# EAGLE design Starlings Technology nrf52 (EAGLE 9.6.2)
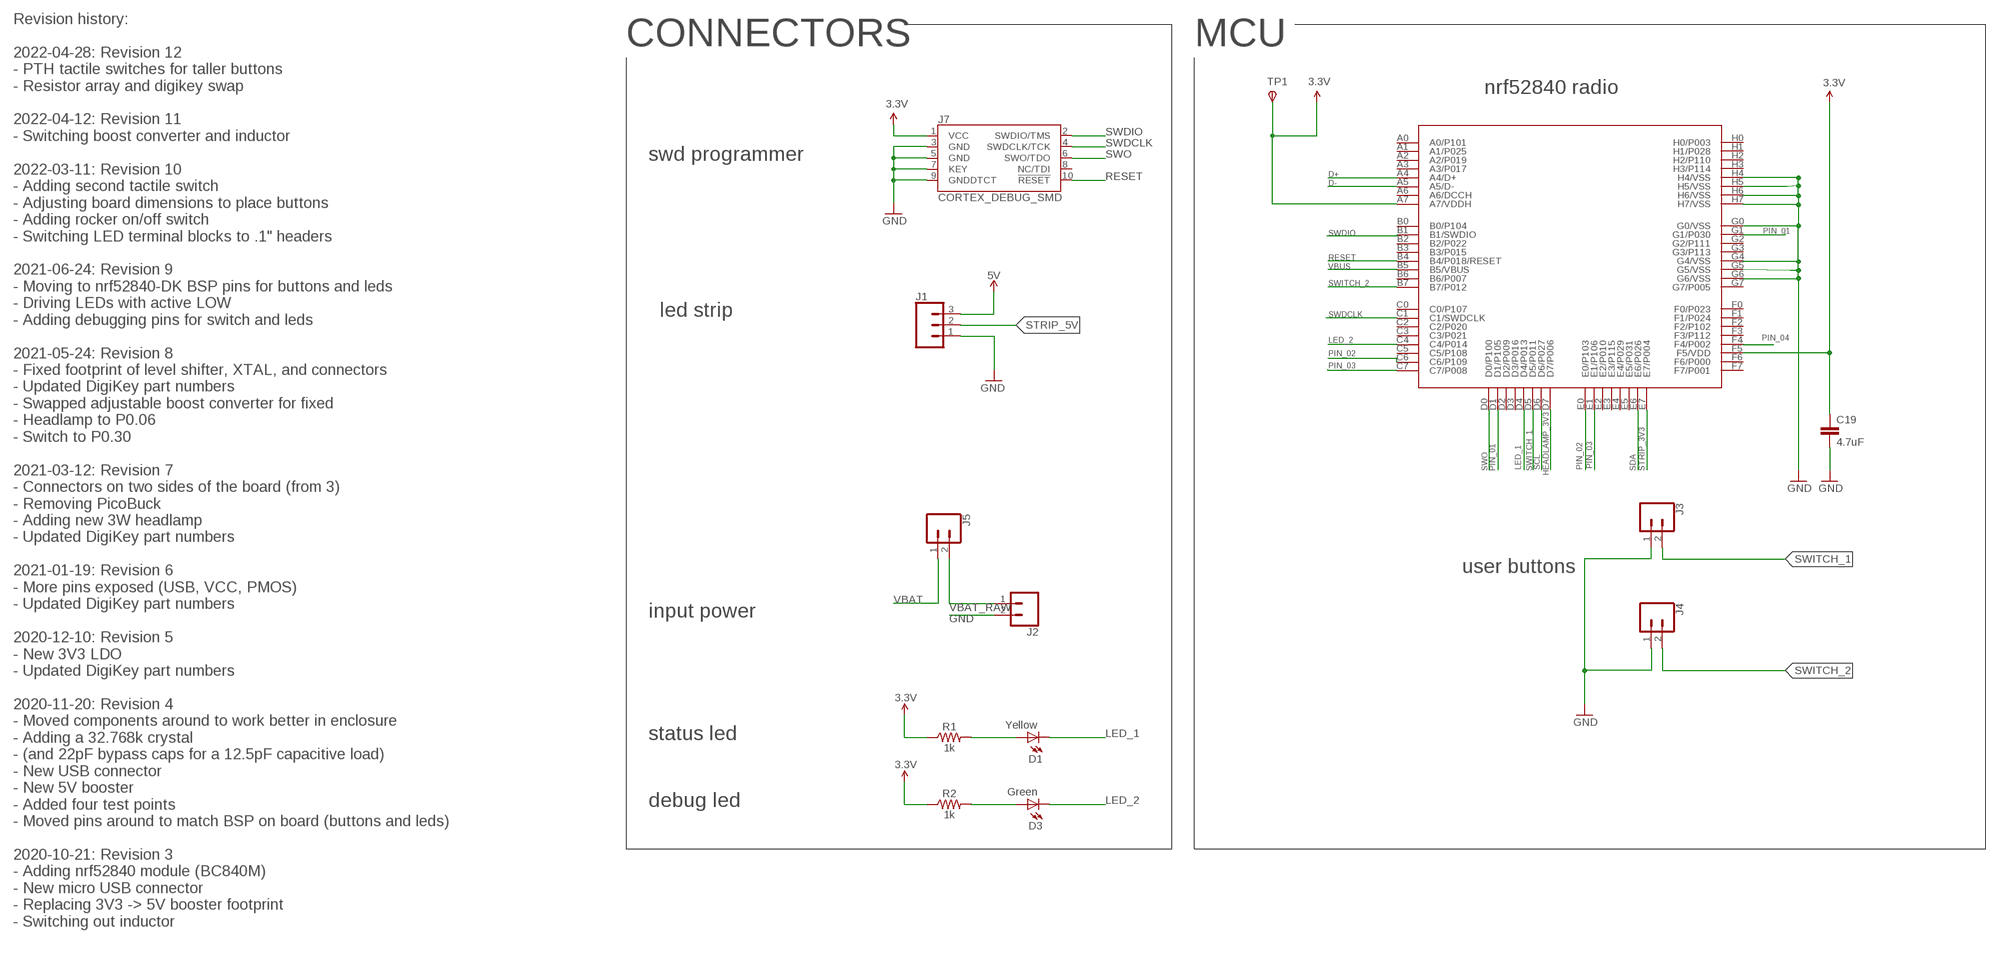
[diagram p0: schematic, sheet 1, part 1 of 2]
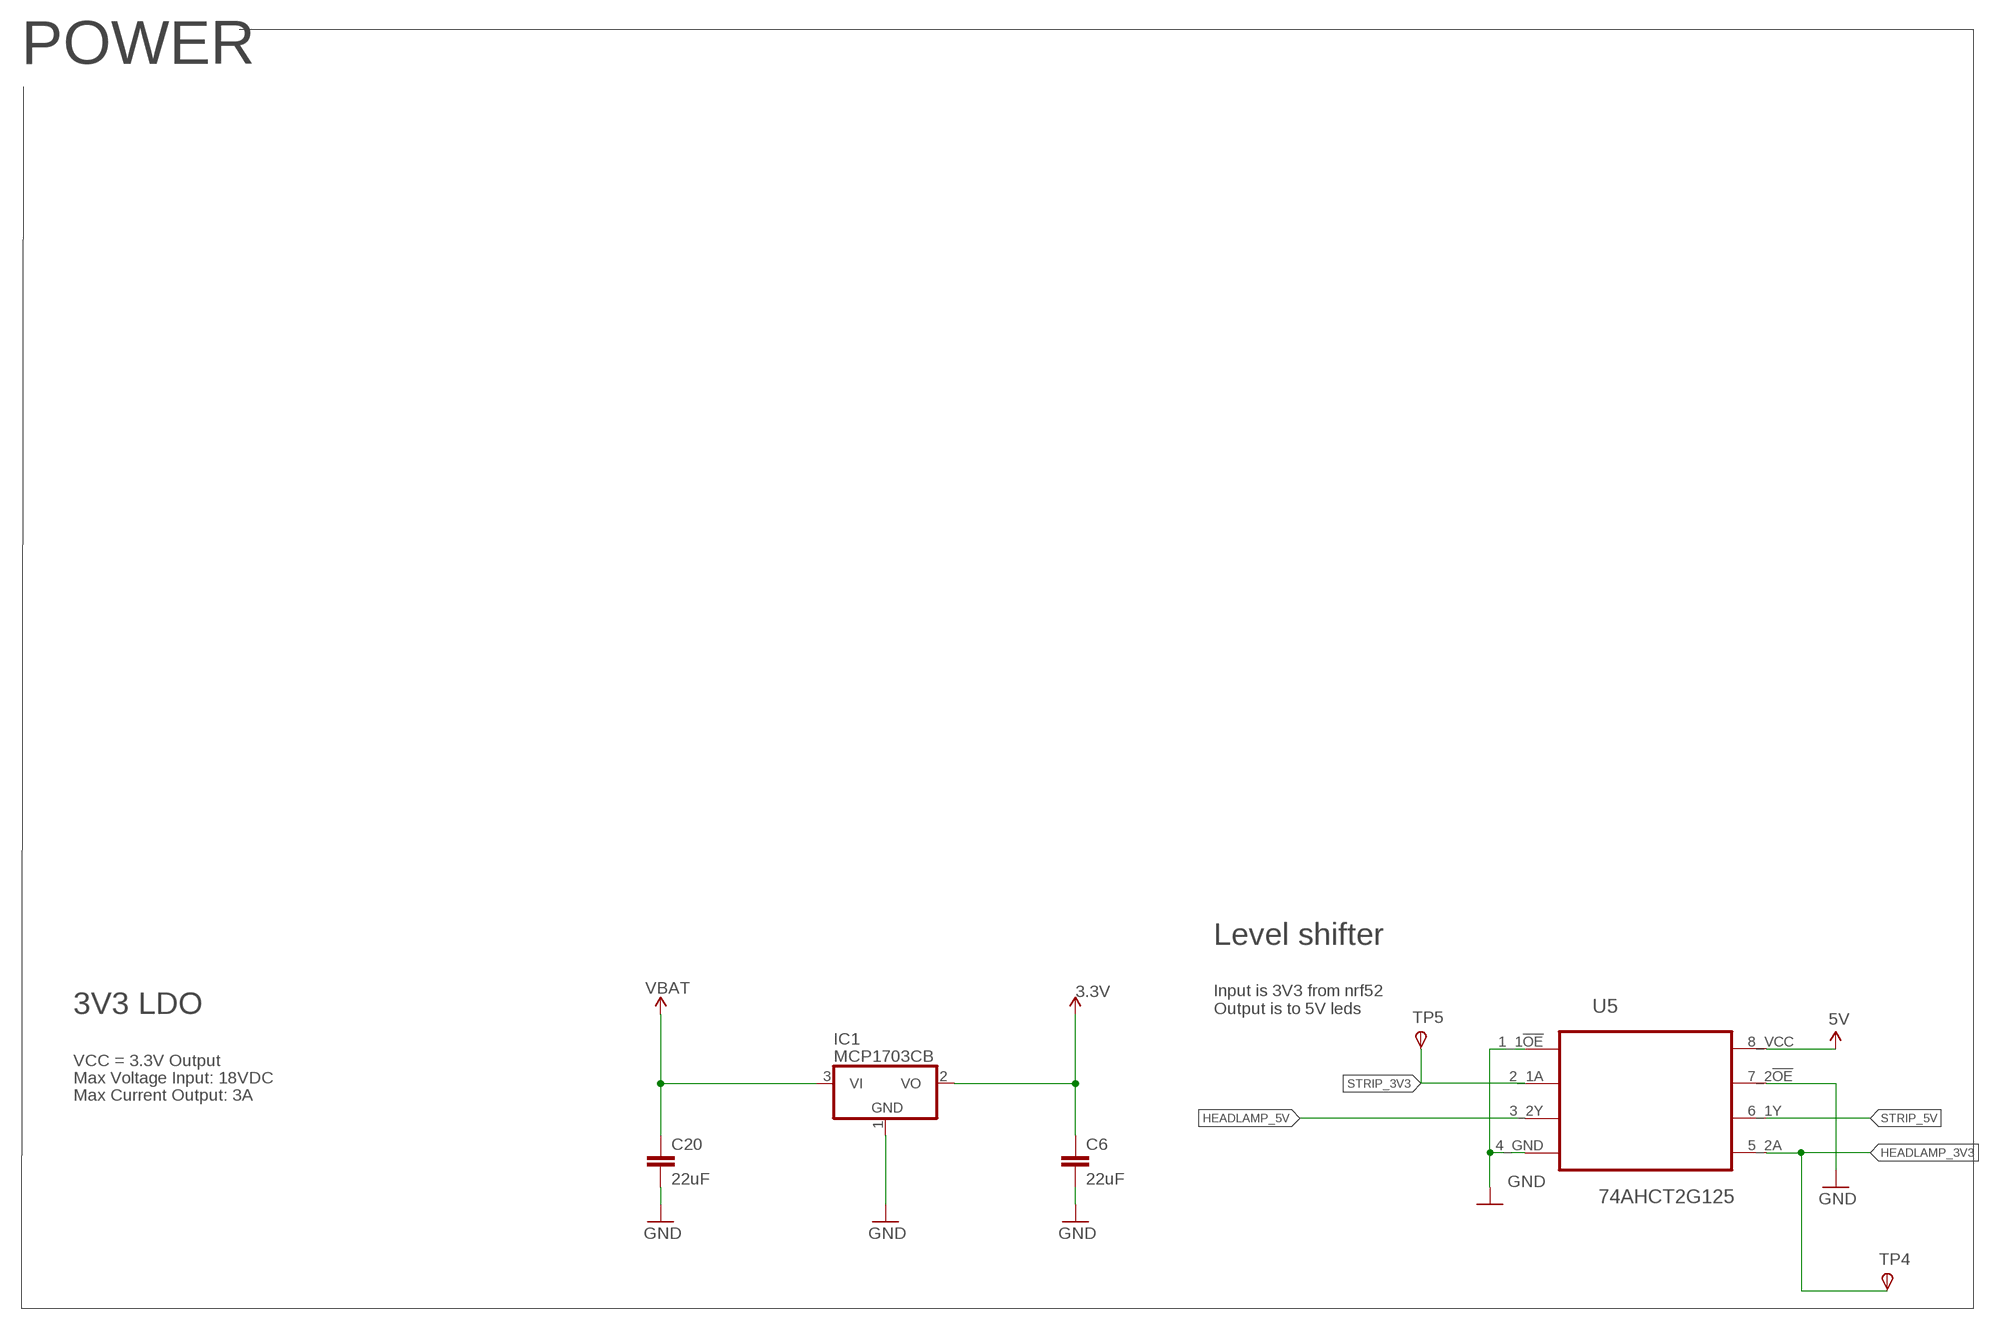
[diagram p1: schematic, sheet 1, part 2 of 2]

## Parts
C6  22uF  22UF-0805-6.3V-20%  [0805]
C19  4.7uF  4.7UF0603  [0603]
C20  22uF  22UF-0805-6.3V-20%  [0805]
D1  Yellow  LED0603  [LED-0603]
D3  Green  LED0603  [LED-0603]
IC1  MCP1703CB  [SOT23]
J1  CONN_03LOCK_LONGPADS  [1X03_LOCK_LONGPADS]
J2  CONN_02LOCK_LONGPADS  [1X02_LOCK_LONGPADS]
J3  CONN_02LOCK_LONGPADS  [1X02_LOCK_LONGPADS]
J4  CONN_02LOCK_LONGPADS  [1X02_LOCK_LONGPADS]
J5  CONN_02LOCK_LONGPADS  [1X02_LOCK_LONGPADS]
J7  CORTEX_DEBUG_SMD  [SAMTECH_FTSH-105-01]
R1  1k  1KOHM-0603-1/10W-1%  [0603]
R2  1k  1KOHM-0603-1/10W-1%  [0603]
TP1  TPSB1,27  [B1,27]
TP4  TPSB1,27  [B1,27]
TP5  TPSB1,27  [B1,27]
U3  BC840M  [BC840M]
U5  74AHCT2G125  VSSOP-8_DEVICE  [VSSOP-8]

## Nets
3.3V: C6.1 C19.1 IC1.2(VO) J7.1(VCC) R1.1 R2.1 TP1.TP(PP) U3.A7(A7/VDDH) U3.F5(F5/VDD) ; supply symbol labelled VCC
5V: J1.3 U5.8_VCC
D+: U3.A4(A4/D+)
D-: U3.A5(A5/D-)
GND: C6.2 C19.2 C20.2 IC1.1(GND) J1.1 J2.2 J3.1 J4.1 J7.3(GND) J7.5(GND) J7.7(KEY) J7.9(GNDDTCT) U3.G0(G0/VSS) U3.G4(G4/VSS) U3.G5(G5/VSS) U3.G6(G6/VSS) U3.H4(H4/VSS) U3.H5(H5/VSS) U3.H6(H6/VSS) U3.H7(H7/VSS) U5.1_1!OE U5.4_GND U5.7_2!OE
HEADLAMP_3V3: TP4.TP(PP) U3.D7(D7/P006) U5.5_2A
HEADLAMP_5V: U5.3_2Y
LED_1: D1.C U3.D4(D4/P013)
LED_2: D3.C U3.C4(C4/P014)
N$1: D1.A R1.2
N$8: D3.A R2.2
PIN_01: U3.D1(D1/P105) U3.G1(G1/P030)
PIN_02: U3.C6(C6/P109) U3.E0(E0/P103)
PIN_03: U3.C7(C7/P008) U3.E1(E1/P106)
PIN_04: U3.F4(F4/P002)
RESET: J7.10(!RESET) U3.B4(B4/P018/RESET)
SCL: U3.D6(D6/P027)
SDA: U3.E6(E6/P026)
STRIP_3V3: TP5.TP(PP) U3.E7(E7/P004) U5.2_1A
STRIP_5V: J1.2 U5.6_1Y
SWDCLK: J7.4(SWDCLK/TCK) U3.C1(C1/SWDCLK)
SWDIO: J7.2(SWDIO/TMS) U3.B1(B1/SWDIO)
SWITCH_1: J3.2 U3.D5(D5/P011)
SWITCH_2: J4.2 U3.B7(B7/P012)
SWO: J7.6(SWO/TDO) U3.D0(D0/P100)
VBAT: C20.1 IC1.3(VI) J5.1
VBAT_RAW: J2.1 J5.2
VBUS: U3.B5(B5/VBUS)
Unconnected: J7.8(NC/TDI) U3.A0(A0/P101) U3.A1(A1/P025) U3.A2(A2/P019) U3.A3(A3/P017) U3.A6(A6/DCCH) U3.B0(B0/P104) U3.B2(B2/P022) U3.B3(B3/P015) U3.B6(B6/P007) U3.C0(C0/P107) U3.C2(C2/P020) U3.C3(C3/P021) U3.C5(C5/P108) U3.D2(D2/P009) U3.D3(D3/P016) U3.E2(E2/P010) U3.E3(E3/P115) U3.E4(E4/P029) U3.E5(E5/P031) U3.F0(F0/P023) U3.F1(F1/P024) U3.F2(F2/P102) U3.F3(F3/P112) U3.F6(F6/P000) U3.F7(F7/P001) U3.G2(G2/P111) U3.G3(G3/P113) U3.G7(G7/P005) U3.H0(H0/P003) U3.H1(H1/P028) U3.H2(H2/P110) U3.H3(H3/P114)

## Notes on the sheet
- Revision history:
  
  2022-04-28: Revision 12
  - PTH tactile switches for taller buttons
  - Resistor array and digikey swap
  
  2022-04-12: Revision 11
  - Switching boost converter and inductor
  
  2022-03-11: Revision 10
  - Adding second tactile switch
  - Adjusting board dimensions to place buttons
  - Adding rocker on/off switch
  - Switching LED terminal blocks to .1" headers
  
  2021-06-24: Revision 9
  - Moving to nrf52840-DK BSP pins for buttons and leds
  - Driving LEDs with active LOW
  - Adding debugging pins for switch and leds
  
  2021-05-24: Revision 8
  - Fixed footprint of level shifter, XTAL, and connectors
  - Updated DigiKey part numbers
  - Swapped adjustable boost converter for fixed
  - Headlamp to P0.06
  - Switch to P0.30
  
  2021-03-12: Revision 7
  - Connectors on two sides of the board (from 3)
  - Removing PicoBuck
  - Adding new 3W headlamp
  - Updated DigiKey part numbers
  
  2021-01-19: Revision 6
  - More pins exposed (USB, VCC, PMOS)
  - Updated DigiKey part numbers
  
  2020-12-10: Revision 5
  - New 3V3 LDO
  - Updated DigiKey part numbers
  
  2020-11-20: Revision 4
  - Moved components around to work better in enclosure
  - Adding a 32.768k crystal 
  - (and 22pF bypass caps for a 12.5pF capacitive load) 
  - New USB connector
  - New 5V booster
  - Added four test points
  - Moved pins around to match BSP on board (buttons and leds)
  
  2020-10-21: Revision 3
  - Adding nrf52840 module (BC840M)
  - New micro USB connector
  - Replacing 3V3 -> 5V booster footprint
  - Switching out inductor
- CONNECTORS | MCU | POWER
- nrf52840 radio
- swd programmer
- led strip
- user buttons
- input power
- Level shifter
- 3V3 LDO
- Input is 3V3 from nrf52
  Output is to 5V leds
- VCC = 3.3V Output
- Max Voltage Input: 18VDC
- Max Current Output: 3A
- status led
- debug led

## Library data of the parts
C6 C20 = SparkFun-Capacitors:22UF: 22µF ceramic capacitors A capacitor is a passive two-terminal electrical component used to store electrical energy temporarily in an electric field.; DIGIKEY: 490-10511-1-ND; PROD_ID: CAP-08402
C19 = SparkFun-Capacitors:4.7UF: 4.7µF ceramic capacitors A capacitor is a passive two-terminal electrical component used to store electrical energy temporarily in an electric field.; DIGIKEY: 399-3482-1-ND; PROD_ID: CAP-08280
D1 = SparkFun:LED: LEDs Standard schematic elements and footprints for 5mm, 3mm, 1206, and 0603 sized LEDs. 5mm - Spark Fun Electronics SKU : COM-00529 (and others); DIGIKEY: 350-4349-2-ND
D3 = SparkFun:LED: LEDs Standard schematic elements and footprints for 5mm, 3mm, 1206, and 0603 sized LEDs. 5mm - Spark Fun Electronics SKU : COM-00529 (and others); DIGIKEY: 754-1116-1-ND
IC1 = linear:MCP1703: 250 mA, 16V, Low Quiescent Current LDO Regulator Source: http://ww1.microchip.com/downloads/en/DeviceDoc/22049b.pdf; DIGIKEY: AP2138N-3.3TRG1DICT-ND
J1 = SparkFun-Connectors:CONN_03: Multi connection point. Often used as Generic Header-pin footprint for 0.1 inch spaced/style header connections On any of the 0.1 inch spaced packages, you can populate with these: Break Away Headers - Straight <https://www.sparkfun.com/products/116> (PRT-00116) Break Away Male Headers - Right Angle <https://www.sparkfun.com/products/553> (PRT-00553) Female Headers <https://www.sparkfun.com/products/115> (PRT-00115) Break Away Headers - Machine Pin <https://www.sparkfun.com/products/117> (PRT-00117) Break Away Female Headers - Swiss Machine Pin <https://www.sparkfun.com/products/743> (PRT-00743) Stackable Header - 3 Pin (Female, 0.1") <https://www.sparkfun.com/products/13875> (PRT-13875) For SCREWTERMINALS and SPRING TERMINALS visit here: Screw Terimnals on SparkFun.com <https://www.sparkfun.com/search/results?term=Screw+Terminals> (5mm/3.5mm/2.54mm spacing) This device is also useful as a general connection point to wire up your design to another part of your project. Our various solder wires solder well into these plated through hole pads. Hook-Up Wire - Assortment (Stranded, 22 AWG) <https://www.sparkfun.com/products/11375> (PRT-11375) Hook-Up Wire - Assortment (Solid Core, 22 AWG) <https://www.sparkfun.com/products/11367> (PRT-11367) View the entire wire category on our website here <https://www.sparkfun.com/categories/141> Special notes: Molex polarized connector foot print use with SKU : PRT-08232 with associated crimp pins and housings.; DIGIKEY: S1111EC-03-ND
J2-J5 = SparkFun-Connectors:CONN_02: Multi connection point. Often used as Generic Header-pin footprint for 0.1 inch spaced/style header connections On any of the 0.1 inch spaced packages, you can populate with these: Break Away Headers - Straight <https://www.sparkfun.com/products/116> (PRT-00116) Break Away Male Headers - Right Angle <https://www.sparkfun.com/products/553> (PRT-00553) Female Headers <https://www.sparkfun.com/products/115> (PRT-00115) Break Away Headers - Machine Pin <https://www.sparkfun.com/products/117> (PRT-00117) Break Away Female Headers - Swiss Machine Pin <https://www.sparkfun.com/products/743> (PRT-00743) For SCREWTERMINALS and SPRING TERMINALS visit here: Screw Terimnals on SparkFun.com <https://www.sparkfun.com/search/results?term=Screw+Terminals> (5mm/3.5mm/2.54mm spacing) This device is also useful as a general connection point to wire up your design to another part of your project. Our various solder wires solder well into these plated through hole pads. Hook-Up Wire - Assortment (Stranded, 22 AWG) <https://www.sparkfun.com/products/11375> (PRT-11375) Hook-Up Wire - Assortment (Solid Core, 22 AWG) <https://www.sparkfun.com/products/11367> (PRT-11367) View the entire wire category on our website here <https://www.sparkfun.com/categories/141> Special notes: Molex polarized connector foot print use with: PRT-08233 with associated crimp pins and housings. 2.54_SCREWTERM for use with PRT-10571. 3.5mm Screw Terminal footprints for PRT-08084 5mm Screw Terminal footprints for use with PRT-08432
J7 = SparkFun-Connectors:CORTEX_DEBUG: Cortex Debug Connector - 10 pin Supports JTAG debug, Serial Wire debug, and Serial Wire Viewer. PTH and SMD connector options available. General Connector Information <http://infocenter.arm.com/help/topic/com.arm.doc.faqs/attached/13634/cortex_debug_connectors.pdf> Products: PTH Connector <http://www.digikey.com/product-detail/en/cnc-tech/3220-10-0100-00/1175-1627-ND/3883661> -via Digi-Key SparkFun PSoc <https://www.sparkfun.com/products/13229> SparkFun T <https://www.sparkfun.com/products/13810>; DIGIKEY: SAM1161-05-ND
R1 R2 = SparkFun-Resistors:1KOHM: 1kΩ resistor A resistor is a passive two-terminal electrical component that implements electrical resistance as a circuit element. Resistors act to reduce current flow, and, at the same time, act to lower voltage levels within circuits. - Wikipedia; DIGIKEY: RNCP0603FTD1K00CT-ND; PROD_ID: RES-07856
TP1 TP4 TP5 = testpad:TPS: TEST PIN
U3 = BC840M-v1:BC840M; DIGIKEY: 1914-BC840CT-ND
U5 = VSSOP8:VSSOP-8_DEVICE: Dual bidirectional I2C-bus and SMBus voltage-level translator; DIGIKEY: 1727-6544-1-ND‎; MPN: PCA9306DC,125; OC_FARNELL: -; OC_NEWARK: 70R6429; PACKAGE: VSSOP-8; SUPPLIER: NXP

## Net classes
0 default: width 0.127 mm, drill 0.305 mm, clearance 0.152 mm
1 power: width 0.508 mm

## Board
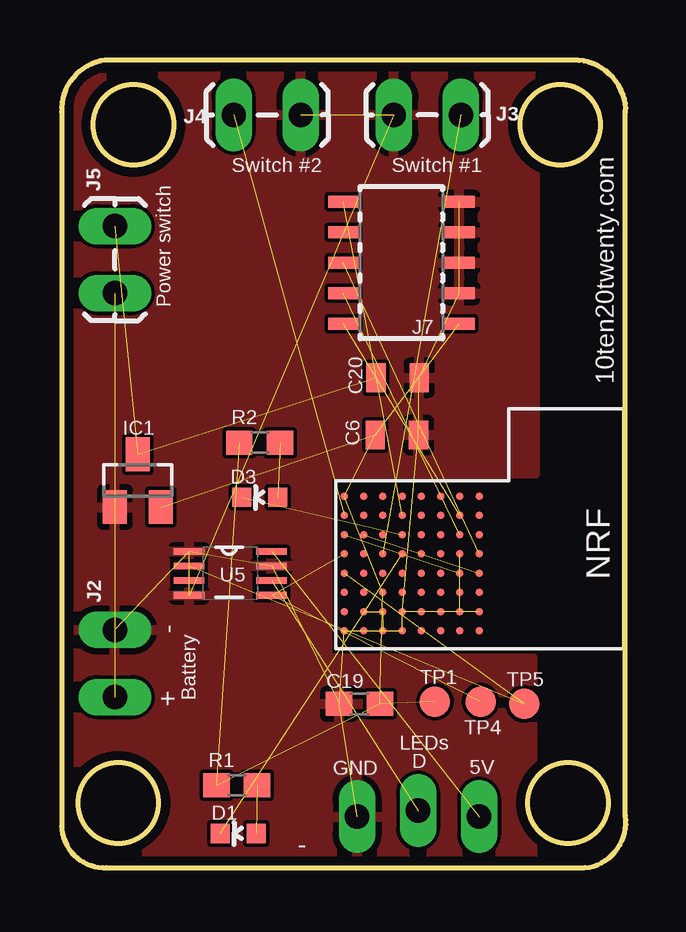
[diagram p2: board, top side]
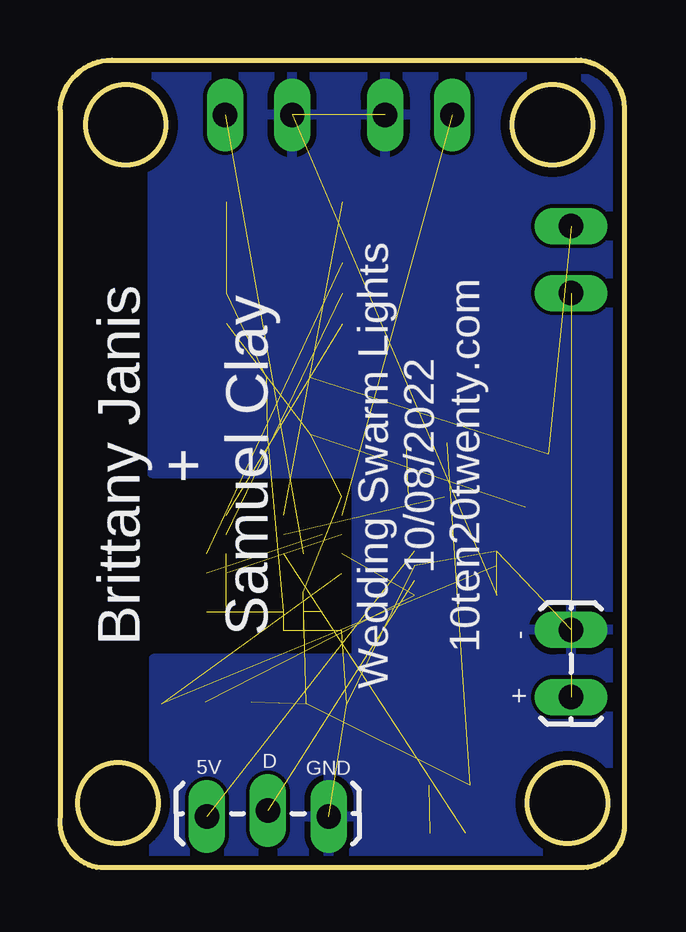
[diagram p3: board, bottom side, seen from below]

Size 23.52 x 33.66 mm. Coordinates in mm from the lower left corner, seen from the top.
Outline: 0,31.49 0,1.72 arc90 1.88,0 21.8,0 21.99,0.01 arc85 23.5,2.17 23.5,31.49 23.52,31.65 arc85 21.36,33.66 2.01,33.66 1.82,33.65 arc85 0,31.49
Outline: circle at 20.78,30.96 radius 1.68
Outline: circle at 2.37,2.7 radius 1.68
Outline: circle at 3,30.96 radius 1.68
Outline: circle at 21.1,2.7 radius 1.68
Copper layers (1*16): Top 0.035559375mm / dielectric 1.6mm / Bottom 0.035559375mm
Design rules "oshpark-2layer-tented": minimum track width 6mil, minimum drill 10mil, track to track 6mil, track to pad 6mil, pad to pad 6mil, via to via 6mil, smd to smd 6mil, copper to edge 15mil, drill to drill 6mil, minimum pad ring 5mil, minimum via ring 5mil, stop-mask expansion 2.5mil, vias tented up to drill 20mil, thermal gap 10mil

### Footprints (pad centres in the part's own frame; a part is rotated, then mirrored left to right if it is on the bottom)
0805 = smd 0.8 x 1.2: 1 -0.9,0; 2 0.9,0
0603 = smd 1.1 x 1: 1 -0.85,0; 2 0.85,0
LED-0603 = smd 0.8 x 0.8: A 0,-0.75; C 0,0.75
SOT23 = smd 1 x 1.4: 1 -0.95,-1.1; 2 0.95,-1.1; 3 0,1.1
1X03_LOCK_LONGPADS = drill 1.016 long: 1 0,0; 2 2.54,-0.254; 3 5.08,0
1X02_LOCK_LONGPADS = drill 1.016 long: 1 -0.127,0; 2 2.667,0
SAMTECH_FTSH-105-01 = smd 0.508 x 1.27: 1 -2.54,-2.413; 2 -2.54,2.413; 3 -1.27,-2.413; 4 -1.27,2.413; 5 0,-2.413; 6 0,2.413; 7 1.27,-2.413; 8 1.27,2.413; 9 2.54,-2.413; 10 2.54,2.413
B1,27 = smd 1.27 x 1.27: TP 0,0
BC840M = smd 0.305 x 0.305: A0 0.66,5.966; A1 0.66,5.153; A2 0.66,4.366; A3 0.66,3.553; A4 0.66,2.765; A5 0.66,1.953; A6 0.66,1.165; A7 0.66,0.352; B0 1.448,5.966; B1 1.448,5.153; B2 1.448,4.366; B3 1.448,3.553; B4 1.448,2.765; B5 1.448,1.953; B6 1.448,1.165; B7 1.448,0.352; C0 2.261,5.966; C1 2.261,5.153; C2 2.261,4.366; C3 2.261,3.553; C4 2.261,2.765; C5 2.261,1.953; C6 2.261,1.165; C7 2.261,0.352; D0 3.048,5.966; D1 3.048,5.153; D2 3.048,4.366; D3 3.048,3.553; D4 3.048,2.765; D5 3.048,1.953; D6 3.048,1.165; D7 3.048,0.352; E0 3.861,5.966; E1 3.861,5.153; E2 3.861,4.366; E3 3.861,3.553; E4 3.861,2.765; E5 3.861,1.953; E6 3.861,1.165; E7 3.861,0.352; F0 4.648,5.966; F1 4.648,5.153; F2 4.648,4.366; F3 4.648,3.553; F4 4.648,2.765; F5 4.648,1.953; F6 4.648,1.165; F7 4.648,0.352; G0 5.461,5.966; G1 5.461,5.153; G2 5.461,4.366; G3 5.461,3.553; G4 5.461,2.765; G5 5.461,1.953; G6 5.461,1.165; G7 5.461,0.352; H0 6.248,5.966; H1 6.248,5.153; H2 6.248,4.366; H3 6.248,3.553; H4 6.248,2.765; H5 6.248,1.953; H6 6.248,1.165; H7 6.248,0.352
VSSOP-8 = smd 1.27 x 0.279: 1_1!OE -1.673,0.862; 2_1A -1.673,0.254; 3_2Y -1.673,-0.354; 4_GND -1.673,-0.962; 5_2A 1.773,-0.962; 6_1Y 1.773,-0.354; 7_2!OE 1.773,0.254; 8_VCC 1.773,0.862

### Placement (x,y rotation side)
C6  13.97,18.03 0 top
C19  12.41,6.83 180 top
C20  14,20.42 0 top
D1  7.37,1.43 90 top
D3  8.25,15.43 90 top
IC1  3.18,16.13 0 top
J1  12.32,2.13 180 bottom
J2  2.22,7.24 90 bottom
J3  13.97,31.37 0 top
J4  9.84,31.37 180 top
J5  2.22,26.61 270 top
J7  14.16,25.21 90 top
R1  7.3,3.43 0 top
R2  8.25,17.72 0 top
TP1  15.56,6.92 0 top
TP4  17.46,6.92 0 top
TP5  19.27,6.83 0 top
U3  11.43,16.13 270 top
U5  6.98,12.32 0 top

### Tracks (layer width: path | path; a pad name or v marks a point on that pad's centre or on a via)
3.3V  (8 unrouted)
5V  (1 unrouted)
GND  (22 unrouted)
  pour Top (isolate 0.005): -0.32,34.23 19.72,34.23 19.72,16.41 11.08,16.41 11.08,8.73 19.62,8.73 19.62,-0.38 -0.32,-0.38
  pour Bottom (isolate 0.005): -0.63,34.23 19.68,34.23 19.68,16.45 11.18,16.45 11.18,8.7 19.62,8.7 19.62,-0.06 -0.63,-0.06
HEADLAMP_3V3  (2 unrouted)
LED_1  (1 unrouted)
LED_2  (1 unrouted)
N$1  (1 unrouted)
N$8  (1 unrouted)
PIN_01  (1 unrouted)
PIN_02  (1 unrouted)
PIN_03  (1 unrouted)
RESET  (1 unrouted)
STRIP_3V3  (2 unrouted)
STRIP_5V  (1 unrouted)
SWDCLK  (1 unrouted)
SWDIO  (1 unrouted)
SWITCH_1  (1 unrouted)
SWITCH_2  (1 unrouted)
SWO  (1 unrouted)
VBAT  (2 unrouted)
VBAT_RAW  (1 unrouted)

### Text on the board
tPlace: Switch #2 | Switch #1 | Power switch | 10ten20twenty.com | NRF | - | + | Battery | LEDs | GND | D | 5V | -
bPlace: Wedding Swarm Lights / 10/08/2022 / 10ten20twenty.com | Brittany Janis / + / Samuel Clay | - | + | GND | D | 5V